# Altium schematic sheet PC4_AudioInput.SchDoc
size 254 x 241 mm
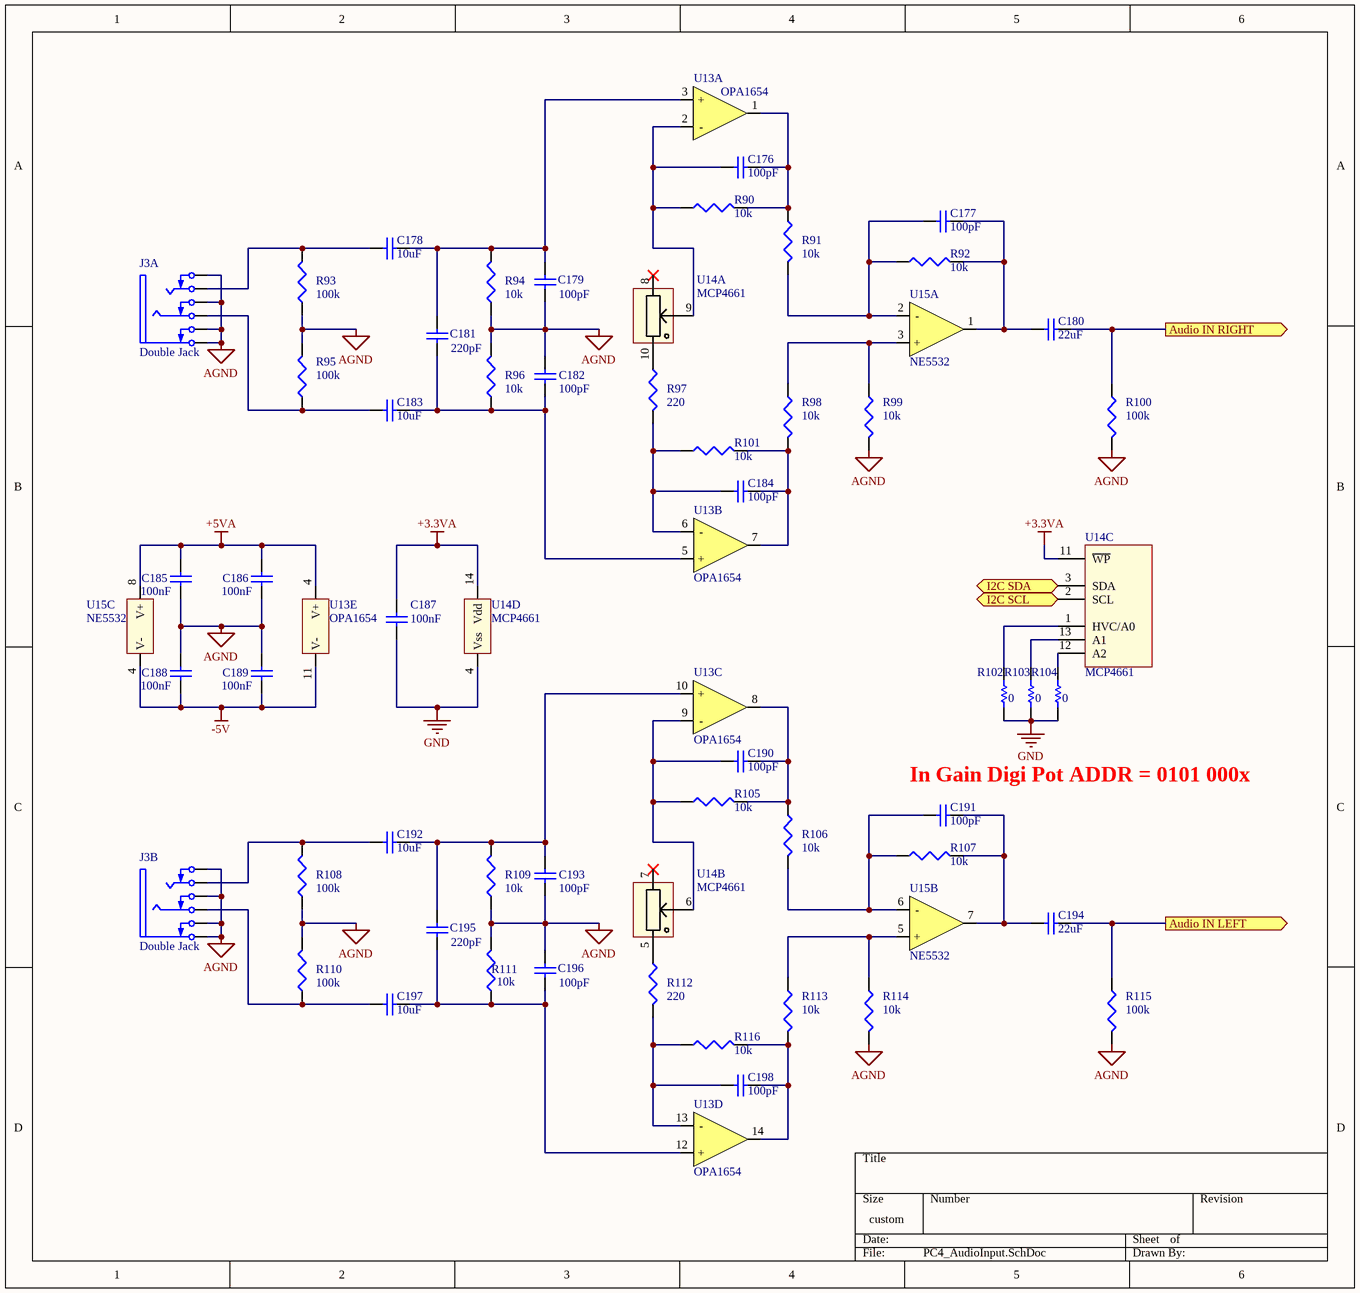
[diagram p0: PC4_AudioInput.SchDoc]

## Parts
C176  value 100pF  [CAPC1608X08]  (hidden comment: Cap 100pF)
C177  value 100pF  [CAPC1608X08]  (hidden comment: Cap 100pF)
C178  value 10uF  [CAPC1608X08]  (hidden comment: Cap 10uF)
C179  value 100pF  [CAPC1608X08]  (hidden comment: Cap 100pF)
C180  value 22uF  [CAPC1608X08]  (hidden comment: Cap 22uF)
C181  value 220pF  [CAPC1608X08]  (hidden comment: Cap 220pF)
C182  value 100pF  [CAPC1608X08]  (hidden comment: Cap 100pF)
C183  value 10uF  [CAPC1608X08]  (hidden comment: Cap 10uF)
C184  value 100pF  [CAPC1608X08]  (hidden comment: Cap 100pF)
C185  value 100nF  [CAPC1608X08]  (hidden comment: Cap 100nF)
C186  value 100nF  [CAPC1608X08]  (hidden comment: Cap 100nF)
C187  value 100nF  [CAPC1608X08]  (hidden comment: Cap 100nF)
C188  value 100nF  [CAPC1608X08]  (hidden comment: Cap 100nF)
C189  value 100nF  [CAPC1608X08]  (hidden comment: Cap 100nF)
C190  value 100pF  [CAPC1608X08]  (hidden comment: Cap 100pF)
C191  value 100pF  [CAPC1608X08]  (hidden comment: Cap 100pF)
C192  value 10uF  [CAPC1608X08]  (hidden comment: Cap 10uF)
C193  value 100pF  [CAPC1608X08]  (hidden comment: Cap 100pF)
C194  value 22uF  [CAPC1608X08]  (hidden comment: Cap 22uF)
C195  value 220pF  [CAPC1608X08]  (hidden comment: Cap 220pF)
C196  value 100pF  [CAPC1608X08]  (hidden comment: Cap 100pF)
C197  value 10uF  [CAPC1608X08]  (hidden comment: Cap 10uF)
C198  value 100pF  [CAPC1608X08]  (hidden comment: Cap 100pF)
J3  Double Jack  [Amphenol_ACJS-MHDC]  (parts A,B of 2)
R90  value 10k  [RESC1608X05]  (hidden comment: Res 10k)
R91  value 10k  [RESC1608X05]  (hidden comment: Res 10k)
R92  value 10k  [RESC1608X05]  (hidden comment: Res 10k)
R93  value 100k  [RESC1608X05]  (hidden comment: Res 100k)
R94  value 10k  [RESC1608X05]  (hidden comment: Res 10k)
R95  value 100k  [RESC1608X05]  (hidden comment: Res 100k)
R96  value 10k  [RESC1608X05]  (hidden comment: Res 10k)
R97  value 220  [RESC1608X05]  (hidden comment: Cap 220)
R98  value 10k  [RESC1608X05]  (hidden comment: Res 10k)
R99  value 10k  [RESC1608X05]  (hidden comment: Res 10k)
R100  value 100k  [RESC1608X05]  (hidden comment: Res 100k)
R101  value 10k  [RESC1608X05]  (hidden comment: Res 10k)
R102  value 0  [RESC1608X05]  (hidden comment: Res 0 Ohm)
R103  value 0  [RESC1608X05]  (hidden comment: Res 0 Ohm)
R104  value 0  [RESC1608X05]  (hidden comment: Res 0 Ohm)
R105  value 10k  [RESC1608X05]  (hidden comment: Res 10k)
R106  value 10k  [RESC1608X05]  (hidden comment: Res 10k)
R107  value 10k  [RESC1608X05]  (hidden comment: Res 10k)
R108  value 100k  [RESC1608X05]  (hidden comment: Res 100k)
R109  value 10k  [RESC1608X05]  (hidden comment: Res 10k)
R110  value 100k  [RESC1608X05]  (hidden comment: Res 100k)
R111  value 10k  [RESC1608X05]  (hidden comment: Res 10k)
R112  value 220  [RESC1608X05]  (hidden comment: Cap 220)
R113  value 10k  [RESC1608X05]  (hidden comment: Res 10k)
R114  value 10k  [RESC1608X05]  (hidden comment: Res 10k)
R115  value 100k  [RESC1608X05]  (hidden comment: Res 100k)
R116  value 10k  [RESC1608X05]  (hidden comment: Res 10k)
U13  OPA1654  [D14-M]  (parts A,B,C,D,E of 5)
U14  MCP4661  [TSSOP14_MC-M]  (parts A,B,C,D of 4)
U15  NE5532  [D8-M]  (parts A,B,C of 3)

## Ports
Audio IN LEFT (out), Audio IN RIGHT (out), I2C SCL, I2C SDA

## Nets
+3.3VA: C187.1 U14.11(~{WP}) U14.14(Vdd)
+5VA: C185.1 C186.1 U13.4(V+) U15.8(V+)
-5V: C188.2 C189.2 U13.11(V-) U15.4(V-)
AGND: C179.2 C182.1 C185.2 C186.2 C188.1 C189.1 C193.2 C196.1 J3.1(SB) J3.2(RB) J3.3(TB) J3.4(S) J3.7(SB) J3.8(RB) J3.9(TB) J3.10(S) R93.1 R94.1 R95.2 R96.2 R99.2 R100.2 R108.1 R109.1 R110.2 R111.2 R114.2 R115.2
GND: C187.2 R102.1 R103.1 R104.1 U14.4(Vss)
Audio IN LEFT: C194.1 R115.1 ; port Audio IN LEFT
Audio IN RIGHT: C180.1 R100.1 ; port Audio IN RIGHT
I2C SCL: U14.2(SCL) ; port I2C SCL
I2C SDA: U14.3(SDA) ; port I2C SDA
NetC176_1: C176.1 R90.1 U13.2(-) U14.9(P0W)
NetC176_2: C176.2 R90.2 R91.1 U13.1(OUT)
NetC177_1: C177.1 R91.2 R92.1 U15.2(-)
NetC177_2: C177.2 C180.2 R92.2 U15.1(OUT)
NetC178_1: C178.1 C179.1 C181.1 R94.2 U13.3(+)
NetC178_2: C178.2 J3.12(T) R93.2
NetC181_2: C181.2 C182.2 C183.1 R96.1 U13.5(+)
NetC183_2: C183.2 J3.11(R) R95.1
NetC184_1: C184.1 R97.2 R101.1 U13.6(-)
NetC184_2: C184.2 R98.2 R101.2 U13.7(OUT)
NetC190_1: C190.1 R105.1 U13.9(-) U14.6(P1W)
NetC190_2: C190.2 R105.2 R106.1 U13.8(OUT)
NetC191_1: C191.1 R106.2 R107.1 U15.6(-)
NetC191_2: C191.2 C194.2 R107.2 U15.7(OUT)
NetC192_1: C192.1 C193.1 C195.1 R109.2 U13.10(+)
NetC192_2: C192.2 J3.6(T) R108.2
NetC195_2: C195.2 C196.2 C197.1 R111.1 U13.12(+)
NetC197_2: C197.2 J3.5(R) R110.1
NetC198_1: C198.1 R112.2 R116.1 U13.13(-)
NetC198_2: C198.2 R113.2 R116.2 U13.14(OUT)
NetR97_1: R97.1 U14.10(P0B)
NetR98_1: R98.1 R99.1 U15.3(+)
NetR102_2: R102.2 U14.1(HVC/A0)
NetR103_2: R103.2 U14.13(A1)
NetR104_2: R104.2 U14.12(A2)
NetR112_1: R112.1 U14.5(P1B)
NetR113_1: R113.1 R114.1 U15.5(+)

Not connected (* = marked no-connect by the designer): U14 7(P1A)* 8(P0A)*

## Notes on the sheet
- (near C191) In Gain Digi Pot ADDR = 0101 000x

## Library data of the parts
C176 C177 C179 C182 C184 C190 C191 C193 C196 C198 = Cap Semi: Capacitor; Fabricant: MULTICOMP; Fournisseur: Farnell; RefFabricant: MCMT18N101F250CT; RefFournisseur: 1856128; Case: 0603 [1608 Metric]; DataSheet: http://www.farnell.com/datasheets/1825496.pdf
C178 C183 C192 C197 = Cap Semi: Capacitor; Fabricant: TDK; Fournisseur: Farnell; RefFabricant: C1608X5R1A106M080AC; RefFournisseur: 2309028; Case: 0603 [1608 Metric]; DataSheet: http://www.farnell.com/datasheets/2291921.pdf
C180 C194 = Cap Semi: Capacitor; Fabricant: MURATA; Fournisseur: Farnell; RefFabricant: GRM188R61A226ME15D; RefFournisseur: 2426957; Case: 0603 [1608 Metric]; DataSheet: http://www.farnell.com/datasheets/2047978.pdf
C181 C195 = Cap Semi: Capacitor; Fabricant: YAGEO; Fournisseur: Farnell; RefFabricant: CC0603JRNPO9BN221; RefFournisseur: 430948; Case: 0603 [1608 Metric]; DataSheet: http://www.farnell.com/datasheets/2213336.pdf
C185-C189 = Cap Semi: Capacitor; Fabricant: KEMET; Fournisseur: Farnell; RefFabricant: C0603T104K5RALTU; RefFournisseur: 2522432; Case: 0603 [1608 Metric]
J3 = Dual TRS Jack Bypassed: Dual Jack stereo bypassed; Fabricant: AMPHENOL; Fournisseur: Farnell; RefFabricant: ACJS-MHDC; RefFournisseur: 2771861; DataSheet: http://www.farnell.com/datasheets/866888.pdf
R90-R92 R94 R96 R98 R99 R101 R105-R107 R109 R111 R113 R114 R116 = Res3: Resistor; Fabricant: TE CONNECTIVITY; Fournisseur: Farnell; RefFabricant: CRGH0603J10K; RefFournisseur: 2331740; Case: 0603 [1608 Metric]; DataSheet: CRGH0603J10K
R93 R95 R100 R108 R110 R115 = Res3: Resistor; Fabricant: TE CONNECTIVITY; Fournisseur: Farnell; RefFabricant: RN73C1J100KBTDF; RefFournisseur: 2687850; Case: 0603 [1608 Metric]; DataSheet: http://www.farnell.com/datasheets/2189072.pdf
R97 R112 = Res3: Capacitor; Fabricant: TE CONNECTIVITY; Fournisseur: Farnell; RefFabricant: CRGH0603J220R; RefFournisseur: 2331717; Case: 0603 [1608 Metric]
R102-R104 = Res1: Resistor; Fabricant: VISHAY; Fournisseur: Farnell; RefFabricant: CRCW06030000Z0EB; RefFournisseur: 2616741; Case: 0603 [1608 Metric]
U13 = OPA1654: Quad Audio OpAmp; Fabricant: TEXAS INSTRUMENTS; RefFournisseur: 2099889; Fournisseur: Farnell; RefFabricant: OPA1654; DataSheet: http://www.ti.com/lit/ds/symlink/opa1654.pdf
U14 = MCP4661: Dual DigiPot non volatile I2C; RefFournisseur: 1840724; RefFabricant: MCP4661-503E/ST; Fournisseur: Farnell; Fabricant: MICROCHIP; DataSheet: http://www.farnell.com/datasheets/2243913.pdf
U15 = NE5532: Dual Audio OpAmp; Fournisseur: Farnell; RefFournisseur: 1426379; RefFabricant: NE5532AD8G; Fabricant: ON SEMICONDUCTOR; DataSheet: http://www.farnell.com/datasheets/1777901.pdf